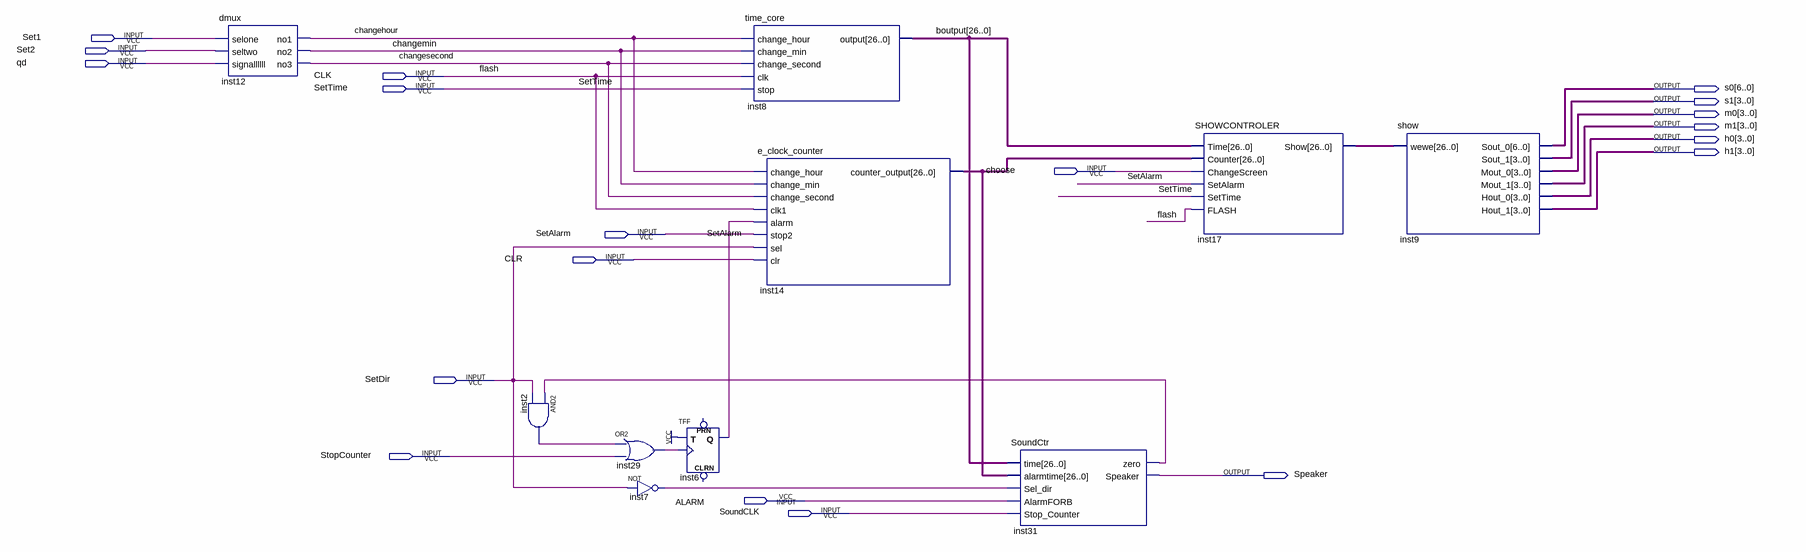
[diagram p0: schematic sheet]
// Quartus schematic e_clock.bdf as structural Verilog: 10 symbols, 19 pins
module e_clock (
  input  Set1,
  input  Set2,
  input  qd,
  input  CLK,
  input  SetTime,
  input  choose,
  input  SetAlarm,
  input  CLR,
  input  SetDir,
  input  StopCounter,
  input  ALARM,
  input  SoundCLK,
  output [6:0] s0,
  output [3:0] s1,
  output [3:0] m0,
  output [3:0] m1,
  output [3:0] h0,
  output [3:0] h1,
  output Speaker
);

  wire changehour, changemin, changesecond, inst2_out, inst6_q, inst7_out, inst29_out, inst31_zero;
  wire [26:0] boutput, inst14_counter_output, inst17_show;

  dmux inst12 (.selone(Set1), .seltwo(Set2), .signallllll(qd), .no1(changehour), .no2(changemin), .no3(changesecond));
  and inst2 (inst2_out, inst31_zero, SetDir);
  or inst29 (inst29_out, inst2_out, StopCounter);
  not inst7 (inst7_out, SetDir);
  TFF inst6 (.T(1'b1), .CLK(inst29_out), .Q(inst6_q));  // open: PRN, CLRN
  time_core inst8 (
    .change_hour(changehour), .change_min(changemin), .change_second(changesecond), .clk(CLK),
    .stop(SetTime), .\output (boutput));
  e_clock_counter inst14 (
    .change_hour(changehour), .change_min(changemin), .change_second(changesecond), .clk1(CLK),
    .alarm(inst6_q), .stop2(SetAlarm), .sel(SetDir), .clr(CLR), .counter_output(inst14_counter_output));
  SoundCtr inst31 (
    .\time (boutput), .alarmtime(inst14_counter_output), .Sel_dir(inst7_out), .AlarmFORB(ALARM),
    .Stop_Counter(SoundCLK), .zero(inst31_zero), .Speaker(Speaker));
  SHOWCONTROLER inst17 (
    .Time(boutput), .Counter(inst14_counter_output), .ChangeScreen(choose), .SetAlarm(SetAlarm),
    .SetTime(SetTime), .FLASH(CLK), .Show(inst17_show));
  show inst9 (.wewe(inst17_show), .Sout_0(s0), .Sout_1(s1), .Mout_0(m0), .Mout_1(m1), .Hout_0(h0), .Hout_1(h1));

  // Other names for the same wires on the sheet: flash = CLK
endmodule
